# Altium schematic sheet FPGA Config.SchDoc
size A
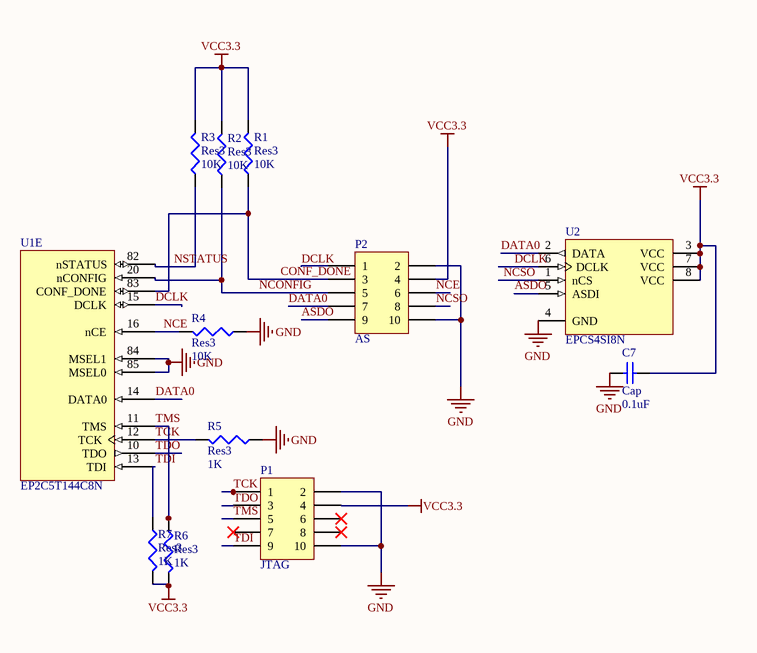
[diagram p0: FPGA Config.SchDoc]

## Parts
C7  Cap  value 0.1uF  [1608[0603]]
P1  JTAG  [HDR2X5]
P2  AS  [HDR2X5]
R1  Res3  value 10K  [J1-0603]
R2  Res3  value 10K  [J1-0603]
R3  Res3  value 10K  [J1-0603]
R4  Res3  value 10K  [J1-0603]
R5  Res3  value 1K  [J1-0603]
R6  Res3  value 1K  [J1-0603]
R7  Res3  value 1K  [J1-0603]
U1  EP2C5T144C8N  [TQFP144_N]  (part E of 9)
U2  EPCS4SI8N  [SOIC8_N]

## Nets
GND: C7.2 P1.2 P1.10 P2.2 P2.10 R4.1 R5.1 U1.84(MSEL1) U1.85(MSEL0) U2.4(GND)
VCC3.3: C7.1 P1.4 P2.4 R1.2 R2.2 R3.2 R6.2 R7.2 U2.3(VCC) U2.7(VCC) U2.8(VCC)
ASDO: P2.9 U2.5(ASDI)
CONF_DONE: P2.3 R1.1 U1.83(CONF_DONE)
DATA0: P2.7 U1.14(DATA0) U2.2(DATA)
DCLK: P2.1 U1.15(DCLK) U2.6(DCLK)
NCE: P2.6 R4.2 U1.16(nCE)
NCONFIG: P2.5 R2.1 U1.20(nCONFIG)
NCSO: P2.8 U2.1(nCS)
NSTATUS: R3.1 U1.82(nSTATUS)
TCK: P1.1 R5.2 U1.12(TCK)
TDI: P1.9 R7.1 U1.13(TDI)
TDO: P1.3 U1.10(TDO)
TMS: P1.5 R6.1 U1.11(TMS)

Not connected (* = marked no-connect by the designer): P1 6* 7* 8*

## Library data of the parts
C7 = Cap Semi: Capacitor (Semiconductor SIM Model); Published: 8-Jun-2000; LatestRevisionDate: 29-May-2009; LatestRevisionNote: IPC-7351 Footprint Added.; PackageReference: C1206; Publisher: Altium Limited; PackageDescription: Chip Capacitor
P1 P2 = Header 5X2: Header, 5-Pin, Dual row; LatestRevisionDate: 17-Jul-2002; LatestRevisionNote: Re-released for DXP Platform.; Publisher: Altium Limited
R1-R7 = Res3: Resistor; Published: 8-Jun-2000; LatestRevisionDate: 29-May-2009; LatestRevisionNote: IPC-7351 Footprint Added.; PackageReference: J1-0603; Publisher: Altium Limited; PackageDescription: Chip Resistor
U1 = EP2C5T144C8N: Cyclone II Family, 1.2V FPGA, 89 I/O Pins, 2 PLLs, 144-Pin TQFP, Speed Grade 8, Commercial Grade, Pb-Free; Published: 4-Mar-2005; LatestRevisionDate: 14-May-2007; LatestRevisionNote: DATA0 pin is now INPUT.; DatasheetVersion: ver3.3, Feb-2008; PackageVersion: ver15.4, Dec-2008; PackageReference: TQFP144; Publisher: Altium Limited; PackageDescription: 144-Pin Plastic Thin Quad Flat Pack (TQFP144) - Wire Bond; Supplier 1: Digi-Key; Supplier Part Number 1: 544-1665-ND; Supplier 2: Farnell; Supplier Part Number 2: 1662263; Supplier 3: Farnell; Supplier Part Number 3: 1453497; Code_JEDEC: MS-026-BFB; ComponentLink1Description: Manufacturer Link; ComponentLink1URL: http://www.altera.com/products/devices/cyclone2/cy2-index.jsp; ComponentLink2Description: Handbook; ComponentLink2URL: http://www.altera.com/literature/hb/cyc2/cyc2_cii5v1.pdf; ComponentLink3Description: Packaging Specification; ComponentLink3URL: http://www.altera.com/literature/ds/dspkg.pdf
U2 = EPCS4SI8N: EPCS4 Series, In-system programmable 3.3V serial configuration device, 8-Pin SOIC, 4-Megabit, Industrial Grade, Pb-Free; Configures: Cyclone II, Stratix II, & Cyclone Devices; Published: 4-Mar-2005; LatestRevisionDate: 13-Apr-2006; LatestRevisionNote: IPC-7351 Footprint Added.; DatasheetVersion: ver2.0, Oct-2003; PackageVersion: ver14.2, Oct-2005; PackageReference: SOIC8; Publisher: Altium Limited; PackageDescription: 8-Pin Small Outline Integrated Circuit Package (SOIC8); Supplier 1: Digi-Key; Supplier Part Number 1: 544-1379-5-ND; Supplier 2: Farnell; Supplier Part Number 2: 1662262; Supplier 3: Farnell; Supplier Part Number 3: 1453496; Code_JEDEC: MS-012-AA; Code_IPC: SOIC127P600-8; ComponentLink1Description: Manufacturer Link; ComponentLink1URL: http://www.altera.com/products/devices/config/cfg-index.html; ComponentLink2Description: Configuration Handbook; ComponentLink2URL: http://www.altera.com/literature/hb/cfg/config_handbook.pdf; ComponentLink3Description: Pinout Specification; ComponentLink3URL: http://www.altera.com/literature/hb/cfg/cyc_c51014.pdf; ComponentLink4Description: Packaging Specification; ComponentLink4URL: http://www.altera.com/literature/ds/dspkg.pdf